# Altium schematic sheet ethernet-phy.SchDoc
size A3; DocumentNumber: 7; SheetNumber: 7; SheetTotal: 45; SheetDescription: Ethernet PHY
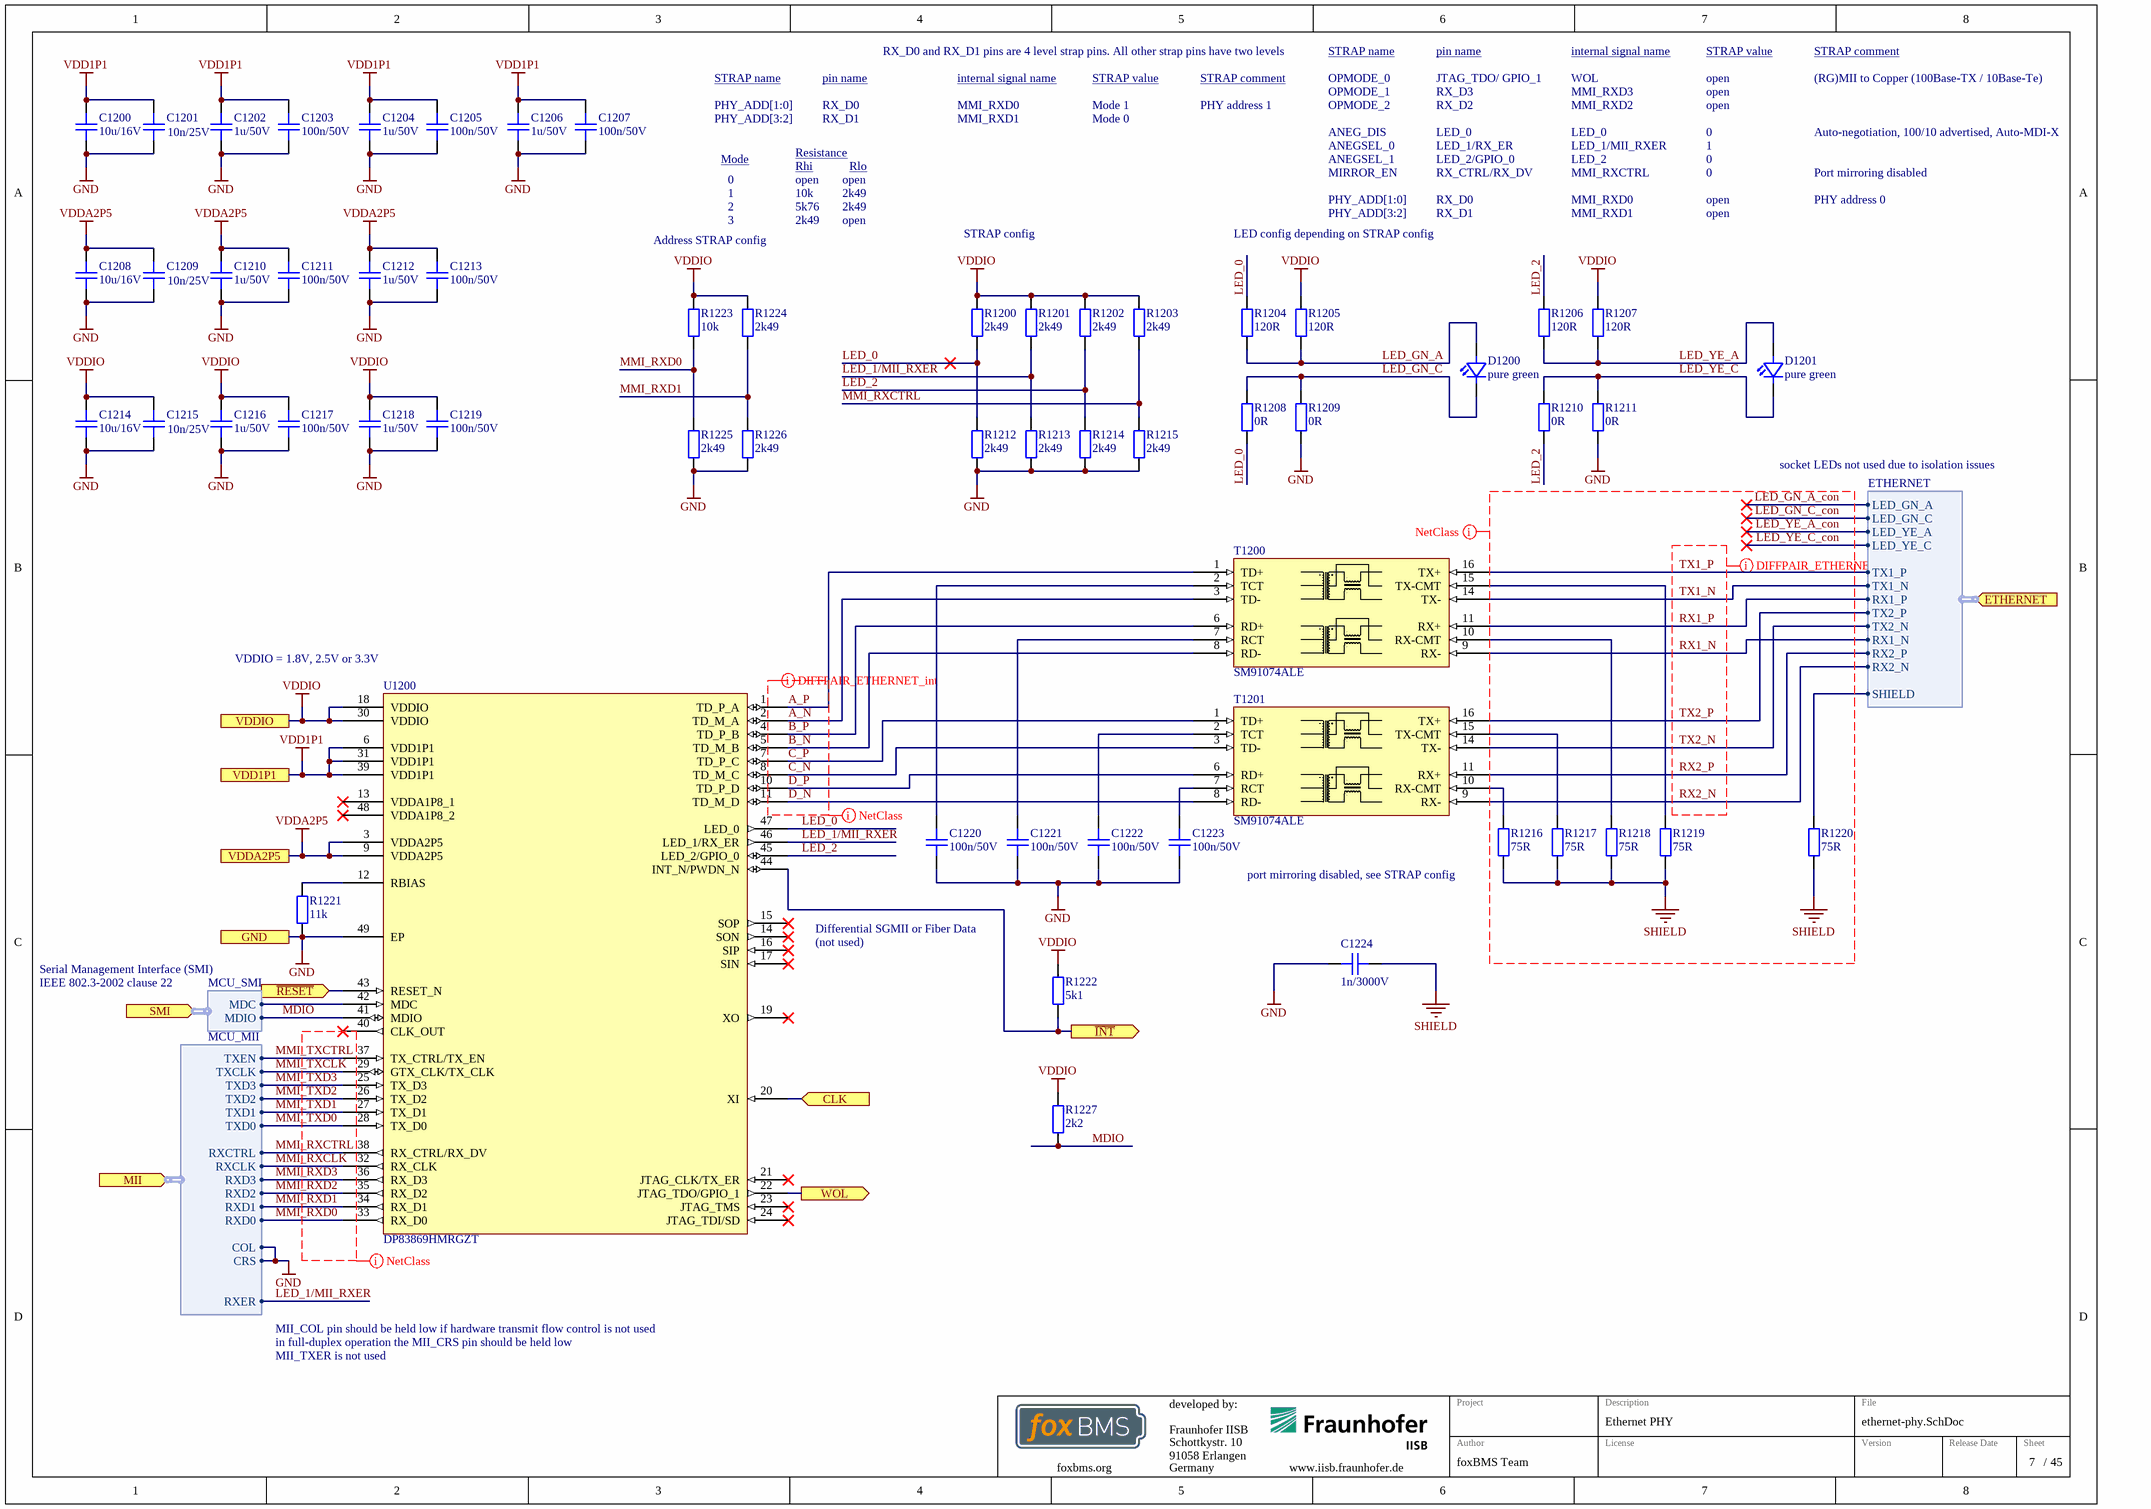
[diagram p0: ethernet-phy.SchDoc]

## Parts
C1200  10u/16V  [CAPC2012X14N]
C1201  10n/25V  [CAPC1005X06N]
C1202  1u/50V  [CAPC1608X08N]
C1203  100n/50V  [CAPC1005X06N]
C1204  1u/50V  [CAPC1608X08N]
C1205  100n/50V  [CAPC1005X06N]
C1206  1u/50V  [CAPC1608X08N]
C1207  100n/50V  [CAPC1005X06N]
C1208  10u/16V  [CAPC2012X14N]
C1209  10n/25V  [CAPC1005X06N]
C1210  1u/50V  [CAPC1608X08N]
C1211  100n/50V  [CAPC1005X06N]
C1212  1u/50V  [CAPC1608X08N]
C1213  100n/50V  [CAPC1005X06N]
C1214  10u/16V  [CAPC2012X14N]
C1215  10n/25V  [CAPC1005X06N]
C1216  1u/50V  [CAPC1608X08N]
C1217  100n/50V  [CAPC1005X06N]
C1218  1u/50V  [CAPC1608X08N]
C1219  100n/50V  [CAPC1005X06N]
C1220  100n/50V  [CAPC1005X06N]
C1221  100n/50V  [CAPC1005X06N]
C1222  100n/50V  [CAPC1005X06N]
C1223  100n/50V  [CAPC1005X06N]
C1224  1n/3000V  [CAPC2220(5750)230_N]
D1200  pure green  [LEDC1608X07N]
D1201  pure green  [LEDC1608X07N]
R1200  2k49  [RESC1005X04N]
R1201  2k49  [RESC1005X04N]
R1202  2k49  [RESC1005X04N]
R1203  2k49  [RESC1005X04N]
R1204  120R  [RESC1005X04N]
R1205  120R  [RESC1005X04N]
R1206  120R  [RESC1005X04N]
R1207  120R  [RESC1005X04N]
R1208  0R  [RESC1005X04N]
R1209  0R  [RESC1005X04N]
R1210  0R  [RESC1005X04N]
R1211  0R  [RESC1005X04N]
R1212  2k49  [RESC1005X04N]
R1213  2k49  [RESC1005X04N]
R1214  2k49  [RESC1005X04N]
R1215  2k49  [RESC1005X04N]
R1216  75R  [RESC1005X04N]
R1217  75R  [RESC1005X04N]
R1218  75R  [RESC1005X04N]
R1219  75R  [RESC1005X04N]
R1220  75R  [RESC1005X04N]
R1221  11k  [RESC1005X04N]
R1222  5k1  [RESC1005X04N]
R1223  10k  [RESC1005X04N]
R1224  2k49  [RESC1005X04N]
R1225  2k49  [RESC1005X04N]
R1226  2k49  [RESC1005X04N]
R1227  2k2  [RESC1005X04N]
T1200  SM91074ALE  [SM91074ALE]
T1201  SM91074ALE  [SM91074ALE]
U1200  DP83869HMRGZT  [DP83869HM-RGZ]

## Ports
CLK (in), ETHERNET (in, harness ETHERNET), GND, MII (in, harness MCU_MII), SMI (in, harness MCU_SMI), VDD1P1, VDDA2P5, VDDIO, WOL (out), ~{INT} (out), ~{RESET} (in)

## Harnesses
MCU_MII: TXD3, TXD2, TXD1, TXD0, TXEN, TXCLK, RXCTRL, RXCLK, RXD3, RXD2, RXD0, RXD1, RXER, COL, CRS
MCU_SMI: MDC, MDIO
ETHERNET: TX1_P, TX1_N, RX1_P, TX2_P, TX2_N, RX1_N, RX2_P, RX2_N, SHIELD, LED_YE_C, LED_YE_A, LED_GN_C, LED_GN_A

## Nets
GND: C1200.1 C1201.1 C1202.1 C1203.1 C1204.1 C1205.1 C1206.1 C1207.1 C1208.1 C1209.1 C1210.1 C1211.1 C1212.1 C1213.1 C1214.1 C1215.1 C1216.1 C1217.1 C1218.1 C1219.1 C1220.1 C1221.1 C1222.1 C1223.1 C1224.1 R1209.1 R1211.1 R1212.1 R1213.1 R1214.1 R1215.1 R1221.1 R1225.1 R1226.1 U1200.49(EP) ; port GND, port MII.COL, port MII.CRS
SHIELD: C1224.2 R1216.1 R1217.1 R1218.1 R1219.1 R1220.1
VDD1P1: C1200.2 C1201.2 C1202.2 C1203.2 C1204.2 C1205.2 C1206.2 C1207.2 U1200.6(VDD1P1) U1200.31(VDD1P1) U1200.39(VDD1P1) ; port VDD1P1
VDDA2P5: C1208.2 C1209.2 C1210.2 C1211.2 C1212.2 C1213.2 U1200.3(VDDA2P5) U1200.9(VDDA2P5) ; port VDDA2P5
VDDIO: C1214.2 C1215.2 C1216.2 C1217.2 C1218.2 C1219.2 R1200.2 R1201.2 R1202.2 R1203.2 R1205.2 R1207.2 R1222.2 R1223.2 R1224.2 R1227.2 U1200.18(VDDIO) U1200.30(VDDIO) ; port VDDIO
~{INT}: R1222.1 U1200.44(INT_N/PWDN_N) ; port ~{INT}
~{RESET}: U1200.43(RESET_N) ; port ~{RESET}
A_N: T1200.3(TD-) U1200.2(TD_M_A)
A_P: T1200.1(TD+) U1200.1(TD_P_A)
B_N: T1200.8(RD-) U1200.5(TD_M_B)
B_P: T1200.6(RD+) U1200.4(TD_P_B)
C_N: T1201.3(TD-) U1200.8(TD_M_C)
C_P: T1201.1(TD+) U1200.7(TD_P_C)
CLK: U1200.20(XI) ; port CLK
D_N: T1201.8(RD-) U1200.11(TD_M_D)
D_P: T1201.6(RD+) U1200.10(TD_P_D)
LED_0: R1200.1 R1204.2 R1208.1 R1212.2 U1200.47(LED_0)
LED_1/MII_RXER: R1201.1 R1213.2 U1200.46(LED_1/RX_ER) ; port MII.RXER
LED_2: R1202.1 R1206.2 R1210.1 R1214.2 U1200.45(LED_2/GPIO_0)
LED_GN_A: D1200.2(A) R1204.1 R1205.1
LED_GN_A_con: port ETHERNET.LED_GN_A
LED_GN_C: D1200.1(C) R1208.2 R1209.2
LED_GN_C_con: port ETHERNET.LED_GN_C
LED_YE_A: D1201.2(A) R1206.1 R1207.1
LED_YE_A_con: port ETHERNET.LED_YE_A
LED_YE_C: D1201.1(C) R1210.2 R1211.2
LED_YE_C_con: port ETHERNET.LED_YE_C
MDIO: R1227.1 U1200.41(MDIO) ; port SMI.MDIO
MMI_RXCLK: U1200.32(RX_CLK) ; port MII.RXCLK
MMI_RXCTRL: R1203.1 R1215.2 U1200.38(RX_CTRL/RX_DV) ; port MII.RXCTRL
MMI_RXD0: R1223.1 R1225.2 U1200.33(RX_D0) ; port MII.RXD0
MMI_RXD1: R1224.1 R1226.2 U1200.34(RX_D1) ; port MII.RXD1
MMI_RXD2: U1200.35(RX_D2) ; port MII.RXD2
MMI_RXD3: U1200.36(RX_D3) ; port MII.RXD3
MMI_TXCLK: U1200.29(GTX_CLK/TX_CLK) ; port MII.TXCLK
MMI_TXCTRL: U1200.37(TX_CTRL/TX_EN) ; port MII.TXEN
MMI_TXD0: U1200.28(TX_D0) ; port MII.TXD0
MMI_TXD1: U1200.27(TX_D1) ; port MII.TXD1
MMI_TXD2: U1200.26(TX_D2) ; port MII.TXD2
MMI_TXD3: U1200.25(TX_D3) ; port MII.TXD3
RX1_N: T1200.9(RX-) ; port ETHERNET.RX1_N
RX1_P: T1200.11(RX+) ; port ETHERNET.RX1_P
RX2_N: T1201.9(RX-) ; port ETHERNET.RX2_N
RX2_P: T1201.11(RX+) ; port ETHERNET.RX2_P
TX1_N: T1200.14(TX-) ; port ETHERNET.TX1_N
TX1_P: T1200.16(TX+) ; port ETHERNET.TX1_P
TX2_N: T1201.14(TX-) ; port ETHERNET.TX2_N
TX2_P: T1201.16(TX+) ; port ETHERNET.TX2_P
WOL: U1200.22(JTAG_TDO/GPIO_1) ; port WOL
NetC1220_2: C1220.2 T1200.2(TCT)
NetC1221_2: C1221.2 T1200.7(RCT)
NetC1222_2: C1222.2 T1201.2(TCT)
NetC1223_2: C1223.2 T1201.7(RCT)
NetR1216_2: R1216.2 T1201.10(RX-CMT)
NetR1217_2: R1217.2 T1201.15(TX-CMT)
NetR1218_2: R1218.2 T1200.10(RX-CMT)
NetR1219_2: R1219.2 T1200.15(TX-CMT)
NetR1220_2: R1220.2 ; port ETHERNET.SHIELD
NetR1221_2: R1221.2 U1200.12(RBIAS)
NetU1200_42: U1200.42(MDC) ; port SMI.MDC

Not connected (* = marked no-connect by the designer): U1200 13(VDDA1P8_1)* 14(SON)* 15(SOP)* 16(SIP)* 17(SIN)* 19(XO)* 21(JTAG_CLK/TX_ER)* 23(JTAG_TMS)* 24(JTAG_TDI/SD)* 40(CLK_OUT)* 48(VDDA1P8_2)*

## Layout directives
differential pair; rule Differential Pairs Routing [Pref Gap = 12.5mil    Min Gap  = 6mil    Max Gap  = 12.5milPref Width = 6mil    Min Width  = 4mil    Max Width  = 10mil]: A_N, A_P, B_N, B_P, C_N, C_P, D_N, D_P, RX1_N, RX1_P, RX2_N, RX2_P, TX1_N, TX1_P, TX2_N, TX2_P
net class ETHERNET_EXT: LED_GN_A_con, LED_GN_C_con, LED_YE_A_con, LED_YE_C_con, RX1_N, RX1_P, RX2_N, RX2_P, SHIELD, TX1_N, TX1_P, TX2_N, TX2_P
net class MCU_MII: (no net found under the mark)
net class ETHERNET_INT: A_N, A_P, B_N, B_P, C_N, C_P, D_N, D_P

## Notes on the sheet
- PHY_ADD[1:0]
- STRAP name
- RX_D0
- pin name
- RX_D0 and RX_D1 pins are 4 level strap pins. All other strap pins have two levels
- MMI_RXD0
- internal signal name
- Mode 1
- STRAP value
- PHY address 1
- STRAP comment
- OPMODE_0
- OPMODE_1
- OPMODE_2
- JTAG_TDO/ GPIO_1
- RX_D3
- RX_D2
- WOL
- MMI_RXD3
- MMI_RXD2
- open
- (RG)MII to Copper (100Base-TX / 10Base-Te)
- PHY_ADD[3:2]
- Mode
- 0
- Resistance
- Rhi
- RX_D1
- Rlo
- MMI_RXD1
- Mode 0
- ANEG_DIS
- ANEGSEL_0
- ANEGSEL_1
- MIRROR_EN
- LED_0
- LED_1/RX_ER
- LED_2/GPIO_0
- RX_CTRL/RX_DV
- LED_1/MII_RXER
- LED_2
- MMI_RXCTRL
- 1
- Auto-negotiation, 100/10 advertised, Auto-MDI-X
- Port mirroring disabled
- Address STRAP config
- 2
- 3
- 10k
- 5k76
- 2k49
- STRAP config
- LED config depending on STRAP config
- PHY address 0
- socket LEDs not used due to isolation issues
- (near U1200) VDDIO = 1.8V, 2.5V or 3.3V
- (near R1216) port mirroring disabled, see STRAP config
- Serial Management Interface (SMI)
- IEEE 802.3-2002 clause 22
- Differential SGMII or Fiber Data
- (not used)
- MII_COL pin should be held low if hardware transmit flow control is not used
- in full-duplex operation the MII_CRS pin should be held low
- MII_TXER is not used
- Fraunhofer IISB
- Schottkystr. 10
- developed by:
- 91058 Erlangen
- Germany
- Author
- Project
- License
- Description
- File
- Version
- Release Date
- Sheet
- foxbms.org <https://foxbms.org>
- www.iisb.fraunhofer.de <https://www.iisb.fraunhofer.de/>
- foxBMS Team
- /

## Library data of the parts
C1200 C1208 C1214 = gen_C_ceramic_10u_16V_X7R_0805: MLCC; Capacitance: 10u; Rated Voltage: 16V; Dielectric: X7S; Case EIA: 0805; Case Metric: 2012; Automotive Qualified: True; AEC-Q Grade: Grade 1; AEC-Q Norm: AEC-Q200; Part Number: gen_C_ceramic_10u_16V_X7R_0805; ECCN: EAR99; Supplier 1: Digikey; Supplier Part Number 1: 445-16110-1-ND
C1201 C1209 C1215 = gen_C_ceramic_10n_25V_X7R_0402: MLCC; Capacitance: 10n; Rated Voltage: 25V; Dielectric: X7R; Case EIA: 0402; Case Metric: 1005; PnP Package: 0402C; PnP Value: 10nF/25V/X7R; PnP equipped: x; Automotive Qualified: True; Part Number: gen_C_ceramic_10n_25V_X7R_0402; Supplier 1: Farnell; Supplier Part Number 1: 2210793
C1202 C1204 C1206 C1210 C1212 C1216 C1218 = gen_C_ceramic_1u_50V_X7R_0603: MLCC; Capacitance: 1u; Rated Voltage: 50V; Dielectric: X7R; Tolerance: ± 10%; Case EIA: 0603; Case Metric: 1608; Automotive Qualified: False; PnP Package: 0603C; Part Number: gen_C_ceramic_1u_50V_X7R_0603; Operating Temperature: -55°C - +125°C; Supplier 1: Farnell; Supplier Part Number 1: 2779055
C1203 C1205 C1207 C1211 C1213 C1217 C1219-C1223 = gen_C_ceramic_100n_50V_X7R_0402: MLCC; Capacitance: 100n; Rated Voltage: 50V; Dielectric: X7R; Case EIA: 0402; Case Metric: 1005; PnP Package: 0402C; PnP Value: 100nF/50V/X7R; PnP equipped: x; Automotive Qualified: True; AEC-Q Norm: AEC-Q200; Part Number: gen_C_ceramic_100n_50V_X7R_0402; Supplier 1: Farnell; Supplier Part Number 1: 2210822; ECCN: EAR99
C1224 = gen_C_ceramic_1n_3000V_X7R_2220: MLCC; Capacitance: 1n; Rated Voltage: 3000V; Dielectric: X7R; Case EIA: 2220; Case Metric: 5750; Automotive Qualified: True; AEC-Q Norm: AEC-Q200; AEC-Q Grade: Grade 0; Part Number: gen_C_ceramic_1n_3000V_X7R_2220; Supplier 1: Digikey; Supplier Part Number 1: 399-16803-1-ND; ECCN: EAR99
D1200 D1201 = LED_0603_pure_green_AECQ: TLMP1100-GS08; Manufacturer: Vishay; Breakdown Voltage: 5V; Continuous Forward Current: 20mA; Forward Voltage @ 20mA: 2.1V; Automotive Qualified: True; Part Number: LED_0603_pure_green_AECQ; Color: pure green; Operating Temperature: -40°C - 100°C; ComponentLink1Description: Datasheet; ComponentLink1URL: http://www.farnell.com/datasheets/2049164.pdf; Supplier 1: Farnell; Supplier Part Number 1: 1328306; Supplier 2: Digikey; Supplier Part Number 2: 751-1176-1-ND; PnP Package: LED_0603
R1200-R1203 R1212-R1215 R1224-R1226 = gen_R_2k49_0402: SMD Resistor 2k49 0402; Tolerance: 1%; Power: 0.063W; Case EIA: 0402; Case Metric: 1005; Maximum Working Voltage: 50V; PnP Package: 0402R; Automotive Qualified: True; Part Number: gen_R_2k49_0402; Operating Temperature: -55°C - +155°C; Resistance: 2k49; Series: E96; PnP Value: 2k49; Supplier 1: Farnell; Supplier Part Number 1: 2059135
R1204-R1207 = gen_R_120R_0402: SMD Resistor 120R 0402; Tolerance: 1%; Power: 0.063W; Case EIA: 0402; Case Metric: 1005; Maximum Working Voltage: 50V; PnP Package: 0402R; Automotive Qualified: True; AEC-Q Norm: AEC-Q200; Part Number: gen_R_120R_0402; Operating Temperature: -55°C - +155°C; Resistance: 120R; Series: E24; PnP Value: 120R; Supplier 1: Farnell; Supplier Part Number 1: 2302535; ECCN: EAR99
R1208-R1211 = gen_R_0R_0402: SMD Resistor 0R 0402; Power: 0.063W; Case EIA: 0402; Case Metric: 1005; Maximum Working Voltage: 50V; PnP Package: 0402R; Automotive Qualified: True; AEC-Q Norm: AEC-Q200; PnP equipped: x; Part Number: gen_R_0R_0402; Operating Temperature: -55°C - +155°C; Resistance: 0R; Series: Jumper; PnP Value: 0R; Supplier 1: Farnell; Supplier Part Number 1: 1469661; Supplier 2: Farnell; Supplier Part Number 2: 2059190; ECCN: EAR99
R1216-R1220 = gen_R_75R_0402: SMD Resistor 75R 0402; Tolerance: 1%; Power: 0.063W; Case EIA: 0402; Case Metric: 1005; Maximum Working Voltage: 50V; PnP Package: 0402R; Automotive Qualified: True; AEC-Q Norm: AEC-Q200; AEC-Q Grade: Grade 0; Part Number: gen_R_75R_0402; Operating Temperature: -55°C - +155°C; Resistance: 75R; Series: E24, E96; PnP Value: 75R; ECCN: EAR99; Supplier 1: Farnell; Supplier Part Number 1: 2059111
R1221 = gen_R_11k_0402: SMD Resistor 11k 0402; Tolerance: 1%; Power: 0.063W; Case EIA: 0402; Case Metric: 1005; Maximum Working Voltage: 50V; PnP Package: 0402R; Automotive Qualified: True; AEC-Q Norm: AEC-Q200; Part Number: gen_R_11k_0402; Operating Temperature: -55°C - +155°C; Resistance: 11k; Series: E24, E96; PnP Value: 11k; ECCN: EAR99; Supplier 1: Farnell; Supplier Part Number 1: 2324762
R1222 = gen_R_5k1_0402: SMD Resistor 5k1 0402; Tolerance: 1%; Power: 0.063W; Case EIA: 0402; Case Metric: 1005; Maximum Working Voltage: 50V; PnP Package: 0402R; Automotive Qualified: True; PnP equipped: x; AEC-Q Norm: AEC-Q200; AEC-Q Grade: Grade 0; Part Number: gen_R_5k1_0402; Operating Temperature: -55°C - +155°C; Resistance: 5k1; Series: E24; PnP Value: 5k1; Supplier 1: Farnell; Supplier Part Number 1: 2302709; ECCN: EAR99
R1223 = gen_R_10k_0402: SMD Resistor 10k 0402; Tolerance: 1%; Power: 0.063W; Case EIA: 0402; Case Metric: 1005; Maximum Working Voltage: 50V; PnP Package: 0402R; PnP equipped: x; Automotive Qualified: True; AEC-Q Norm: AEC-Q200; Part Number: gen_R_10k_0402; Operating Temperature: -55°C - +155°C; Resistance: 10k; Series: E24, E96; PnP Value: 10k; Supplier 1: Farnell; Supplier Part Number 1: 2059239; ECCN: EAR99
R1227 = gen_R_2k2_0402: SMD Resistor 2k2 0402; Tolerance: 1%; Power: 0.063W; Case EIA: 0402; Case Metric: 1005; Maximum Working Voltage: 50V; PnP Package: 0402R; PnP equipped: x; Automotive Qualified: True; AEC-Q Norm: AEC-Q200; Part Number: gen_R_2k2_0402; Operating Temperature: -55°C - +155°C; Resistance: 2k2; Series: E24; PnP Value: 2k2; Supplier 1: Farnell; Supplier Part Number 1: 4136977
T1200 T1201 = SM91074ALE: 10/100 Base-T Transformer; Manufacturer: Bourns; Automotive Qualified: True; Part Number: SM91074ALE; Part Name: SM91074ALE; Operating Temperature: −40°C - +125°C; ComponentLink1Description: Datasheet; ComponentLink1URL: https://datasheet.octopart.com/SM91074ALE-Bourns-datasheet-134093235.pdf; Supplier 1: Farnell; Supplier Part Number 1: 2932105; Supplier 2: Mouser; Supplier Part Number 2: 652-SM91074ALE; Supplier 3: Digikey; Supplier Part Number 3: SM91074ALECT-ND
U1200 = DP83869HMRGZT: High Immunity 10/100/1000 Ethernet Physical Layer Transceiver and Fiber Interface; Manufacturer: Texas Instruments; PnP Package: VQFN-48; Automotive Qualified: False; Part Number: DP83869HMRGZT; Part Name: DP83869HMRGZT; Operating Temperature: −40°C - +125°C; ComponentLink1Description: Datasheet; ComponentLink1URL: http://www.ti.com/lit/ds/symlink/dp83869hm.pdf; Supplier 1: Digikey; Supplier Part Number 1: 296-53377-1-ND; Supplier 2: Mouser; Supplier Part Number 2: 595-DP83869HMRGZT